# Altium schematic sheet VCCINT_IO_BRAM_PS.SchDoc: RFSoC AMC
size 420 x 297 mm; CompanyName: WUT; DrawnBy: T. Przywozki; Organization: WUT ISE; Address1: Warsaw University of Technology; Address2: Nowowiejska 15/19 00-665 Warsaw; Address3: Tomasz.Przywozki@pw.edu.pl; DocumentNumber: 39; Revision: 1; SheetNumber: 39; SheetTotal: 45; Project: RFSoC AMC; ModifiedBy: T. Przywozki; CreateDate: -; CheckedDate: -; DivGrp: ISE; Designer: T. Przywozki; ModifiedDate: -; ProjectName: ADC/DAC MEZZANINE
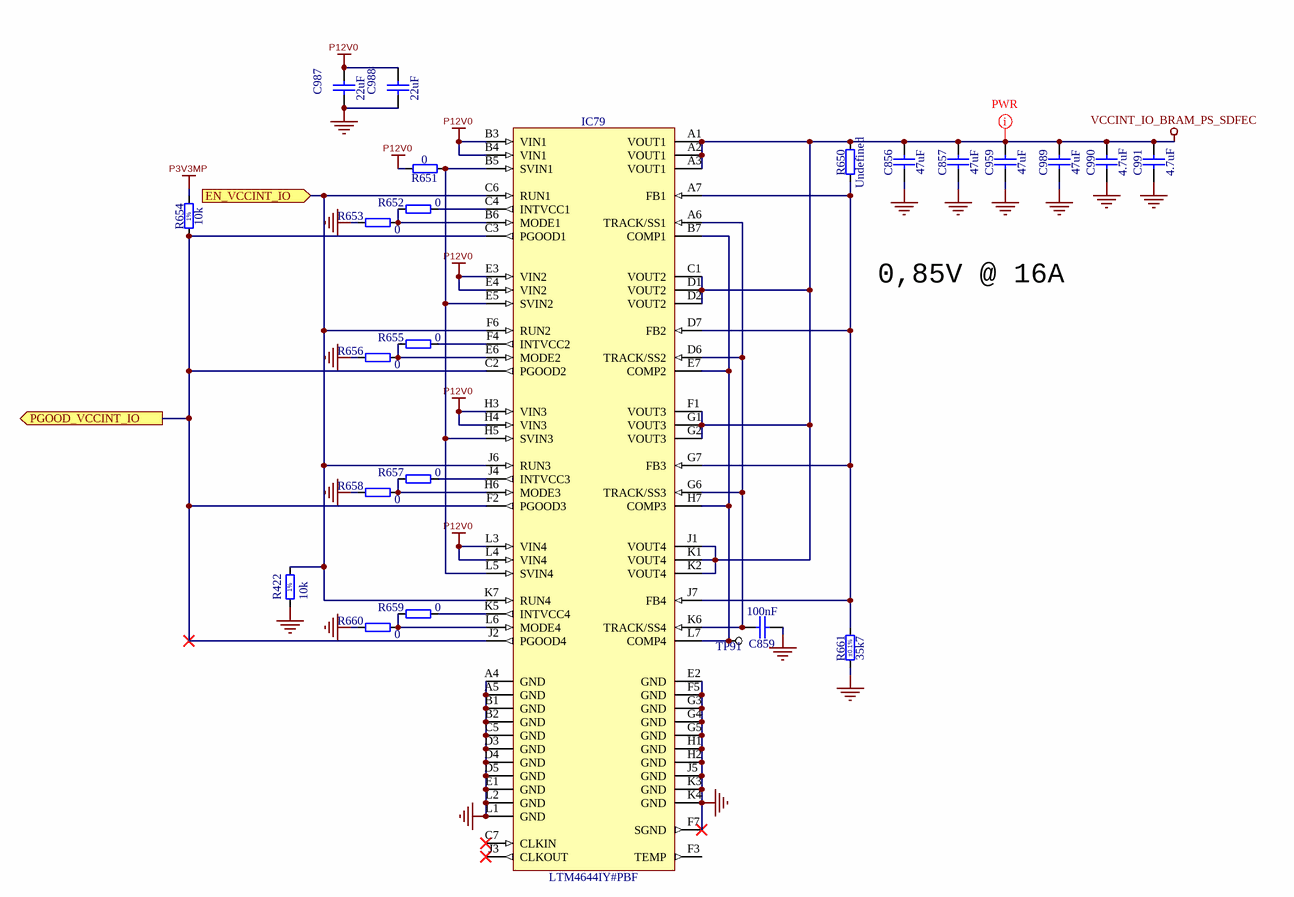
[diagram p0: VCCINT_IO_BRAM_PS.SchDoc]

## Parts
C856  47uF  [CAPC2012X140N]
C857  47uF  [CAPC2012X140N]
C859  100nF  [CAPC1005X55N]
C959  47uF  [CAPC2012X140N]
C987  22uF  [CAPC2012X135N]
C988  22uF  [CAPC2012X135N]
C989  47uF  [CAPC2012X140N]
C990  4.7uF  [CAPC1709X95N]
C991  4.7uF  [CAPC1709X95N]
IC79  LTM4644IY#PBF  [BGA77C127P7X11_900X1500X521]
R422  10k  [RESC1005X40N]
R650  Undefined  [RESC1608X55N]
R651  0  [RESC1005X40N]
R652  0  [RESC1005X40N]
R653  0  [RESC1005X40N]
R654  10k  [RESC1005X40N]
R655  0  [RESC1005X40N]
R656  0  [RESC1005X40N]
R657  0  [RESC1005X40N]
R658  0  [RESC1005X40N]
R659  0  [RESC1005X40N]
R660  0  [RESC1005X40N]
R661  35k7  Tolerance: ±0.1%  [RESC1608X55N]
TP91  TP  [TP]  (value not drawn)

## Ports
EN_VCCINT_IO (in), PGOOD_VCCINT_IO (out)

## Nets
GND: C856.1 C857.1 C859.1 C959.1 C987.1 C988.1 C989.1 C990.1 C991.1 IC79.A4(GND) IC79.A5(GND) IC79.B1(GND) IC79.B2(GND) IC79.C5(GND) IC79.D3(GND) IC79.D4(GND) IC79.D5(GND) IC79.E1(GND) IC79.E2(GND) IC79.F5(GND) IC79.F7(SGND) IC79.G3(GND) IC79.G4(GND) IC79.G5(GND) IC79.H1(GND) IC79.H2(GND) IC79.J5(GND) IC79.K3(GND) IC79.K4(GND) IC79.L1(GND) IC79.L2(GND) R422.1 R653.2 R656.2 R658.2 R660.2 R661.1
P3V3MP: R654.2
P12V0: C987.2 C988.2 IC79.B3(VIN1) IC79.B4(VIN1) IC79.E3(VIN2) IC79.E4(VIN2) IC79.H3(VIN3) IC79.H4(VIN3) IC79.L3(VIN4) IC79.L4(VIN4) R651.2
VCCINT_IO_BRAM_PS_SDFEC: C856.2 C857.2 C959.2 C989.2 C990.2 C991.2 IC79.A1(VOUT1) IC79.A2(VOUT1) IC79.A3(VOUT1) IC79.C1(VOUT2) IC79.D1(VOUT2) IC79.D2(VOUT2) IC79.F1(VOUT3) IC79.G1(VOUT3) IC79.G2(VOUT3) IC79.J1(VOUT4) IC79.K1(VOUT4) IC79.K2(VOUT4) R650.2
EN_VCCINT_IO: IC79.C6(RUN1) IC79.F6(RUN2) IC79.J6(RUN3) IC79.K7(RUN4) R422.2 ; port EN_VCCINT_IO
PGOOD_VCCINT_IO: IC79.C2(PGOOD2) IC79.C3(PGOOD1) IC79.F2(PGOOD3) IC79.J2(PGOOD4) R654.1 ; port PGOOD_VCCINT_IO
NetC859_2: C859.2 IC79.A6(TRACK/SS1) IC79.D6(TRACK/SS2) IC79.G6(TRACK/SS3) IC79.K6(TRACK/SS4)
NetIC79_A7: IC79.A7(FB1) IC79.D7(FB2) IC79.G7(FB3) IC79.J7(FB4) R650.1 R661.2
NetIC79_B5: IC79.B5(SVIN1) IC79.E5(SVIN2) IC79.H5(SVIN3) IC79.L5(SVIN4) R651.1
NetIC79_B6: IC79.B6(MODE1) R652.2 R653.1
NetIC79_B7: IC79.B7(COMP1) IC79.E7(COMP2) IC79.H7(COMP3) IC79.L7(COMP4) TP91.1
NetIC79_C4: IC79.C4(INTVCC1) R652.1
NetIC79_E6: IC79.E6(MODE2) R655.2 R656.1
NetIC79_F4: IC79.F4(INTVCC2) R655.1
NetIC79_H6: IC79.H6(MODE3) R657.2 R658.1
NetIC79_J4: IC79.J4(INTVCC3) R657.1
NetIC79_K5: IC79.K5(INTVCC4) R659.1
NetIC79_L6: IC79.L6(MODE4) R659.2 R660.1

Not connected (* = marked no-connect by the designer): IC79 C7(CLKIN)* F3(TEMP) J3(CLKOUT)*

## Layout directives
net class PWR: VCCINT_IO_BRAM_PS_SDFEC

## Notes on the sheet
- 0,85V @ 16A
- Project/Equipment
- Document
- Designer
- Drawn by
- Check.by
- Copyright WUT ISE 2021
  This documentation describes Open Hardware and is licensed under CERN OHL v.1.1. You may redistribute and modify this documentaction under the terms of the CERN OHL v1.1.
  (http://ohwr.org/CERNOHL). This documentation is dristributed WITHOUT ANY EXPRESS OR IMPLIED WARRANTY, INCLUDING OF MERCHANTABLITY, SATISFACTORY QUALITY AND FITNESS FOR A PARTICULAR PURPOSE. Please see the CERN OHL v.1.1 for applicable conditions
- File
- Last Mod.
- Print Date
- Sheet
- Size
- A3
- of
- Rev
- Contact:
- (in symbol R0402_10K_1%_0.0625W_100PPM) 1%

## Library data of the parts
C856 C857 C959 C989 = CC0805_47UF_6.3V_20%_X5R: Non-polarised capacitor; Manufacturer: GENERIC; Part Description: SMD Multilayer Chip Ceramic Capacitor; Manufacturer1 Part Number: C0805C476M9PACTU; Tolerance: ±20%; Voltage: 6.3V; TC: X5R; Manufacturer Part Number: CC0805_47UF_6.3V_20%_X5R; Part Number: CC0805_47UF_6.3V_20%_X5R; Value: 47uF; Component Kind: Standard; Component Type: Standard; Pin Count: 2; Status: Preferred; Case: 0805; Mounted: Yes; Socket: No; SMD: Yes; Sense: No; Manufacturer1 Example: KEMET; Manufacturer1 ComponentHeight: 1.4mm; HelpURL: \\cern.ch\dfs\Applications\Altium\Datasheets\CC0805_X5R_KEMET.pdf; Author: CERN DEM JLC; CreateDate: 16.10.2012; LatestRevisionDate: 16.10.2012
C859 = CC0402_100NF_16V_10%_X5R: Non-polarised capacitor; Part Description: SMD Multilayer Chip Ceramic Capacitor; Manufacturer: GENERIC; Manufacturer1 Part Number: GRM155R61C104KA88D; Voltage: 16V; TC: X5R; Tolerance: ±10%; Part Number: CC0402_100NF_16V_10%_X5R; Component Kind: Standard; Component Type: Standard; Pin Count: 2; Value: 100nF; Status: None; Manufacturer Part Number: CC0402_100NF_16V_10%_X5R; Case: 0402; Mounted: Yes; Socket: No; SMD: Yes; Sense: No; Manufacturer1 Example: MURATA; Manufacturer1 ComponentHeight: 0.55mm; HelpURL: \\cern.ch\dfs\Applications\Altium\Datasheets\CC0402_X5R_MURATA_GRM.pdf; Author: CERN DEM JLC; CreateDate: 10.12.2013; LatestRevisionDate: 10.12.2013
C987 C988 = CC0805_22UF_16V_10%_X5R: Non-polarised capacitor; Manufacturer: GENERIC; Part Description: SMD Multilayer Chip Ceramic Capacitor; Manufacturer1 Part Number: C2012X5R1C226KT; Tolerance: ±10%; Voltage: 16V; TC: X5R; Manufacturer Part Number: CC0805_22UF_16V_10%_X5R; Part Number: CC0805_22UF_16V_10%_X5R; Value: 22uF; Component Kind: Standard; Component Type: Standard; Pin Count: 2; Status: Preferred; Case: 0805; Mounted: Yes; Socket: No; SMD: Yes; Sense: No; Manufacturer1 Example: TDK; Manufacturer1 ComponentHeight: 1.35mm; HelpURL: \\cern.ch\dfs\Applications\Altium\Datasheets\CC0805_X5R_TDK_C.pdf; Author: CERN DEM JLC; CreateDate: 25.10.2012; LatestRevisionDate: 25.10.2012
C990 C991 = CC0603_4.7UF_16V_10%_X5R: Non-polarised capacitor; Manufacturer: GENERIC; Part Description: SMD Multilayer Chip Ceramic Capacitor; Manufacturer1 Part Number: EMK107ABJ475KA-T; Tolerance: ±10%; Voltage: 16V; TC: X5R; Manufacturer Part Number: CC0603_4.7UF_16V_10%_X5R; Part Number: CC0603_4.7UF_16V_10%_X5R; Value: 4.7uF; Component Kind: Standard; Component Type: Standard; Pin Count: 2; Status: None; Case: 0603; Mounted: Yes; Socket: No; SMD: Yes; Sense: No; Manufacturer1 Example: TAIYO YUDEN; Manufacturer1 ComponentHeight: 0.95mm; HelpURL: \\cern.ch\dfs\Applications\Altium\Datasheets\CC0603_X7R_TAIYO-YUDEN_HIGH-VALUE.pdf; Author: CERN DEM JLC; CreateDate: 16.12.2013; LatestRevisionDate: 16.09.2014
IC79 = LTM4644IY#PBF: Quad DC/DC µModule Regulator with Configurable 4A Output Array; Part Description: 4V-14V to 0.6V-5.5V Quad DC/DC uModule (Power Module) Regulator with Configurable 4A Output Array; Manufacturer: LINEAR TECHNOLOGY; PressFit: No; Bonding: No; Part Number: LTM4644IY#PBF; Component Kind: Standard; Component Type: Standard; Device: LTM4644IY#PBF; PackageDescription: BGA, 1.27mm Pitch, Rect.; 77 Pin, 7 Columns X 11 Rows, 9.00mm X 15.00mm X 5.21mm H; Manufacturer Part Number: LTM4644IY#PBF; Pin Count: 77; Case: BGA77; Mounted: Yes; Socket: No; SMD: Yes; Sense: No; ComponentHeight: 5.21mm; HelpURL: \\cern.ch\dfs\Applications\Altium\Datasheets\LTM4644IY#PBF.pdf; Author: CERN DEM JLC; CreateDate: 25.04.2018; LatestRevisionDate: 25.04.2018
R422 R654 = R0402_10K_1%_0.0625W_100PPM: Resistor - 1%; Manufacturer: GENERIC; Part Description: General Purpose Thick Film Chip Resistor; Manufacturer1 Part Number: 232270671003L; TC: ±100ppm/°C; PressFit: No; Manufacturer Part Number: R0402_10K_1%_0.0625W_100PPM; Part Number: R0402_10K_1%_0.0625W_100PPM; Tolerance: ±1%; Value: 10k; Component Kind: Standard; Component Type: Standard; Pin Count: 2; Status: Not Recommended; Power: 0.0625W; Case: 0402; Mounted: Yes; Sense: No; Socket: No; SMD: Yes; Manufacturer1 Example: YAGEO PHYCOMP; Manufacturer1 ComponentHeight: 0.4mm; HelpURL: \\cern.ch\dfs\Applications\Altium\Datasheets\R0402_Phycomp_RC0402.pdf; Author: CERN DEM JLC
  R422: CreateDate: 03/12/2007; LatestRevisionDate: 17/10/2012
  R654: CreateDate: 03.12.2007; LatestRevisionDate: 17.10.2012
R650 = R0603_NO-VALUE: Resistor; Part Description: Reserved Footprint For a 0603 (1608) Chip Resistor; PressFit: No; Mounted: No; Part Number: R0603_NO-VALUE; Component Kind: Standard; Component Type: Standard; Pin Count: 2; Value: Undefined; Status: None; Manufacturer: Undefined; Manufacturer Part Number: R0603_NO-VALUE; Case: 0603; Sense: No; Socket: No; SMD: Yes; Manufacturer1 Example: Undefined; Manufacturer1 Part Number: Undefined; Manufacturer1 ComponentHeight: Undefined; HelpURL: Undefined; Author: CERN DEM JLC; CreateDate: 03.12.2007; LatestRevisionDate: 13.03.2008
R651-R653 R655-R660 = R0402_0R_JUMPER: Resistor; Manufacturer: GENERIC; Part Description: 1A (0.05R Max DC Resistance) Zero Ohm Jumper; Manufacturer1 Part Number: 232270591001L; PressFit: No; Manufacturer Part Number: R0402_0R_JUMPER; Part Number: R0402_0R_JUMPER; Value: 0; Component Kind: Standard; Component Type: Standard; Pin Count: 2; Status: Not Recommended; Case: 0402; Mounted: Yes; Sense: No; Socket: No; SMD: Yes; Manufacturer1 Example: YAGEO PHYCOMP; Manufacturer1 ComponentHeight: 0.4mm; HelpURL: \\cern.ch\dfs\Applications\Altium\Datasheets\R0402_Phycomp_RC0402.pdf; Author: CERN DEM JLC; CreateDate: 03.12.2007; LatestRevisionDate: 17.10.2012
R661 = R0603_35K7_0.1%_0.063W_10PPM: Resistor - 0.1%; Part Description: Thin Film Chip Resistor; Manufacturer: GENERIC; Manufacturer1 Part Number: RN73C1J35K7BTDF; Power: 0.063W; TC: ±10ppm; PressFit: No; Part Number: R0603_35K7_0.1%_0.063W_10PPM; Component Kind: Standard; Component Type: Standard; Pin Count: 2; Value: 35k7; Status: Not Recommended; Manufacturer Part Number: R0603_35K7_0.1%_0.063W_10PPM; Case: 0603; Mounted: Yes; Sense: No; Socket: No; SMD: Yes; Manufacturer1 Example: TYCO HOLSWORTHY; Manufacturer1 ComponentHeight: 0.5mm; HelpURL: \\cern.ch\dfs\Applications\Altium\Datasheets\R0603_Tyco_RN73.pdf; Author: CERN DEM JLC; CreateDate: 03.12.2007; LatestRevisionDate: 13.03.2008
TP91 = TP: Testpoint